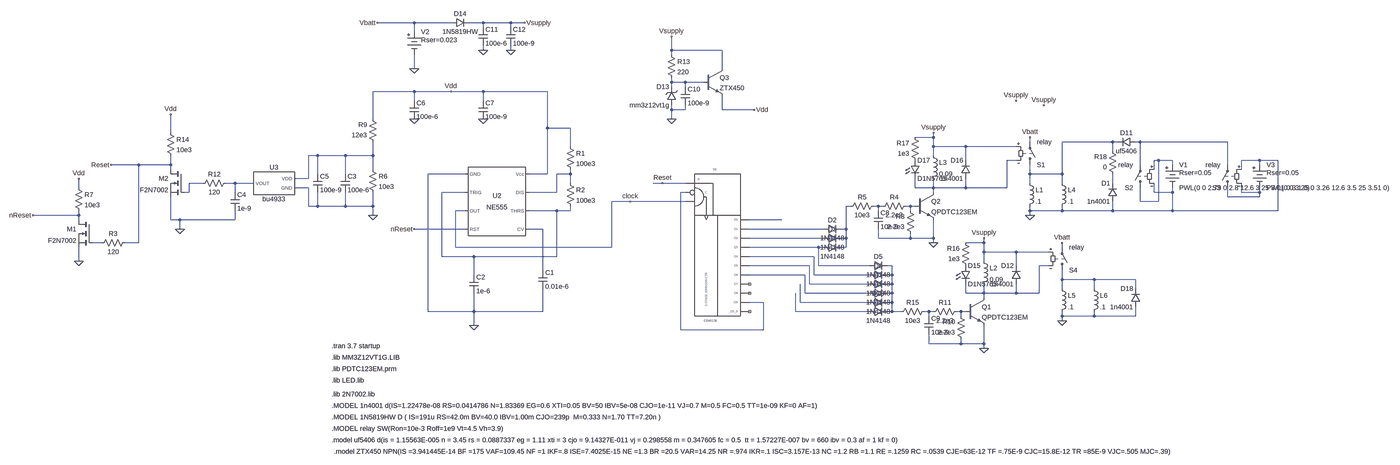
[diagram p0: schematic LockSequencer-6.asc, whole sheet]
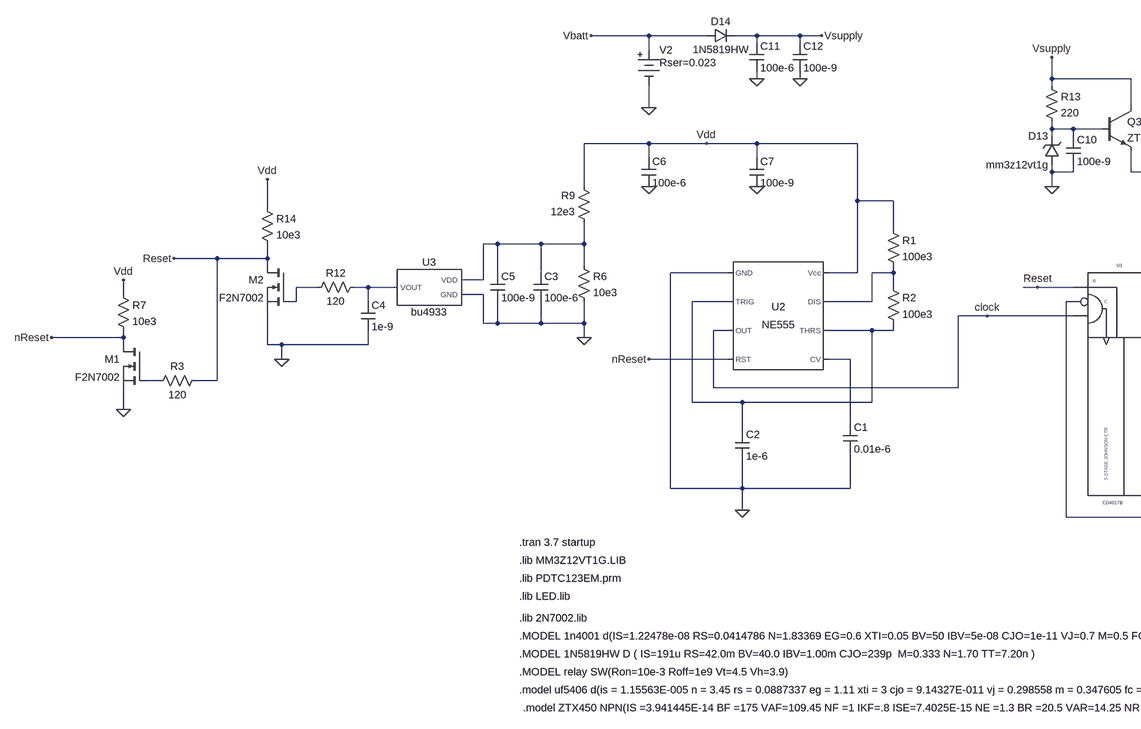
[diagram p1: schematic LockSequencer-6.asc, part, row 1 of 1, column 1 of 2]
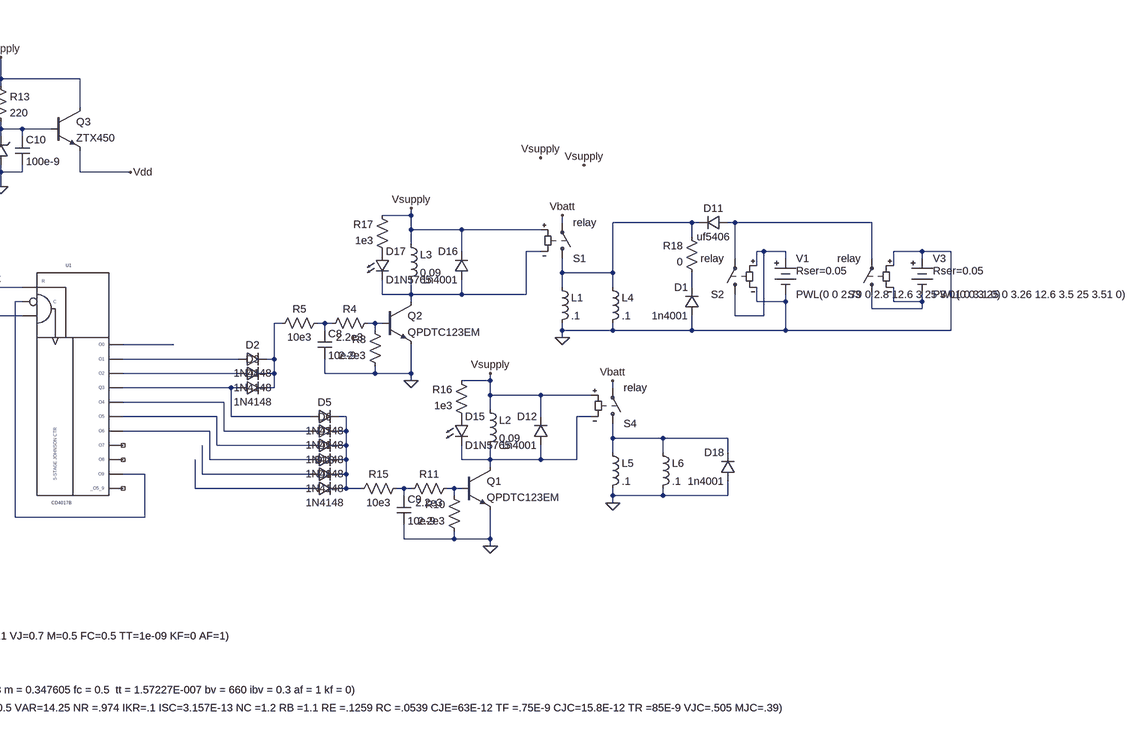
[diagram p2: schematic LockSequencer-6.asc, part, row 1 of 1, column 2 of 2]
LockSequencer-6.asc, the LTspice schematic file:
Version 4
SHEET 1 3068 1020
WIRE -832 -576 -960 -576
WIRE -704 -576 -832 -576
WIRE -592 -576 -640 -576
WIRE -496 -576 -592 -576
WIRE -448 -576 -496 -576
WIRE -592 -560 -592 -576
WIRE -496 -560 -496 -576
WIRE -832 -544 -832 -576
WIRE -592 -480 -592 -496
WIRE -496 -480 -496 -496
WIRE 64 -480 64 -528
WIRE 240 -480 64 -480
WIRE 64 -464 64 -480
WIRE -832 -416 -832 -464
WIRE 240 -416 240 -480
WIRE 64 -368 64 -384
WIRE 112 -368 64 -368
WIRE 176 -368 112 -368
WIRE 64 -352 64 -368
WIRE 112 -352 112 -368
WIRE -832 -336 -976 -336
WIRE -704 -336 -832 -336
WIRE -592 -336 -704 -336
WIRE -368 -336 -592 -336
WIRE -832 -304 -832 -336
WIRE -592 -304 -592 -336
WIRE 64 -272 64 -288
WIRE 112 -272 112 -288
WIRE 112 -272 64 -272
WIRE 240 -272 240 -320
WIRE 352 -272 240 -272
WIRE -976 -240 -976 -336
WIRE 64 -240 64 -272
WIRE -368 -208 -368 -336
WIRE -288 -208 -368 -208
WIRE -1680 -192 -1680 -256
WIRE 976 -176 976 -192
WIRE 976 -176 912 -176
WIRE 1312 -160 1312 -176
WIRE 1600 -160 1424 -160
WIRE 1616 -160 1600 -160
WIRE 1696 -160 1680 -160
WIRE 2000 -160 1696 -160
WIRE -288 -144 -288 -208
WIRE 976 -144 976 -176
WIRE 1088 -144 976 -144
WIRE 1264 -144 1088 -144
WIRE 1600 -128 1600 -160
WIRE -1168 -112 -1200 -112
WIRE -1072 -112 -1168 -112
WIRE -976 -112 -976 -160
WIRE -976 -112 -1072 -112
WIRE 976 -112 976 -144
WIRE 1088 -96 1088 -144
WIRE 1264 -96 1232 -96
WIRE 1760 -96 1744 -96
WIRE 1808 -96 1760 -96
WIRE 2112 -96 2048 -96
WIRE 2176 -96 2112 -96
WIRE -1792 -80 -1888 -80
WIRE -1680 -80 -1680 -112
WIRE -1680 -80 -1792 -80
WIRE 1696 -80 1696 -160
WIRE 1808 -80 1808 -96
WIRE 2000 -80 2000 -160
WIRE 2112 -80 2112 -96
WIRE -1680 -64 -1680 -80
WIRE -976 -64 -976 -112
WIRE 1744 -64 1744 -96
WIRE 2048 -64 2048 -96
WIRE -1168 -48 -1168 -112
WIRE -1072 -48 -1072 -112
WIRE -656 -48 -784 -48
WIRE -368 -48 -368 -208
WIRE -368 -48 -432 -48
WIRE -288 -48 -288 -64
WIRE -288 -48 -336 -48
WIRE 1312 -48 1312 -80
WIRE 1424 -48 1424 -160
WIRE 1424 -48 1312 -48
WIRE -1200 -32 -1200 -112
WIRE -1200 -32 -1248 -32
WIRE -1568 -16 -1616 -16
WIRE -1456 -16 -1488 -16
WIRE -1392 -16 -1456 -16
WIRE -288 -16 -288 -48
WIRE 32 -16 0 -16
WIRE 112 -16 32 -16
WIRE 1312 -16 1312 -48
WIRE 1424 -16 1424 -48
WIRE 1600 -16 1600 -48
WIRE -2000 0 -2000 -32
WIRE -1200 0 -1248 0
WIRE 912 0 912 -32
WIRE 976 0 976 -32
WIRE 976 0 912 0
WIRE 1088 0 1088 -32
WIRE 1088 0 976 0
WIRE 1232 0 1232 -96
WIRE 1232 0 1088 0
WIRE -1616 16 -1616 -16
WIRE -1616 16 -1632 16
WIRE -1456 16 -1456 -16
WIRE -656 16 -736 16
WIRE -336 16 -336 -48
WIRE -336 16 -432 16
WIRE 112 16 96 16
WIRE 976 16 976 0
WIRE 1744 16 1744 -16
WIRE 1808 16 1808 0
WIRE 1808 16 1744 16
WIRE 2048 16 2048 -16
WIRE 2112 16 2112 0
WIRE 2112 16 2048 16
WIRE 2000 32 2000 0
WIRE 2112 32 2112 16
WIRE 2112 32 2000 32
WIRE -80 48 -144 48
WIRE 112 48 -80 48
WIRE 1696 48 1696 0
WIRE 1760 48 1760 -96
WIRE 1760 48 1696 48
WIRE -1200 64 -1200 0
WIRE -1168 64 -1168 16
WIRE -1168 64 -1200 64
WIRE -1072 64 -1072 16
WIRE -1072 64 -1168 64
WIRE -976 64 -976 16
WIRE -976 64 -1072 64
WIRE 688 64 672 64
WIRE 784 64 768 64
WIRE 800 64 784 64
WIRE 896 64 880 64
WIRE 912 64 896 64
WIRE -656 80 -688 80
WIRE -336 80 -432 80
WIRE -288 80 -288 64
WIRE -288 80 -336 80
WIRE 784 80 784 64
WIRE 896 80 896 64
WIRE 1312 80 1312 64
WIRE 1424 80 1424 64
WIRE 1424 80 1312 80
WIRE 1600 80 1600 48
WIRE 1600 80 1424 80
WIRE 1808 80 1808 16
WIRE 1808 80 1600 80
WIRE 2176 80 2176 -96
WIRE 2176 80 1808 80
WIRE -2000 96 -2000 80
WIRE -2000 96 -2160 96
WIRE -976 96 -976 64
WIRE 1312 96 1312 80
WIRE -2000 112 -2000 96
WIRE -1680 112 -1680 32
WIRE -1648 112 -1680 112
WIRE -1456 112 -1456 80
WIRE -1456 112 -1648 112
WIRE 448 112 336 112
WIRE -1648 144 -1648 112
WIRE -656 144 -832 144
WIRE -384 144 -432 144
WIRE 592 144 336 144
WIRE 672 144 672 64
WIRE 672 144 656 144
WIRE 592 176 336 176
WIRE 672 176 672 144
WIRE 672 176 656 176
WIRE 784 176 784 144
WIRE 896 176 896 160
WIRE 896 176 784 176
WIRE 976 176 976 112
WIRE 976 176 896 176
WIRE -1920 192 -1952 192
WIRE -1792 192 -1792 -80
WIRE -1792 192 -1840 192
WIRE 976 192 976 176
WIRE 1152 192 1152 176
WIRE 1152 192 1088 192
WIRE -688 208 -688 80
WIRE -144 208 -144 48
WIRE -144 208 -688 208
WIRE 576 208 336 208
WIRE 592 208 576 208
WIRE 672 208 672 176
WIRE 672 208 656 208
WIRE 1424 208 1424 192
WIRE 1152 224 1152 192
WIRE 1264 224 1152 224
WIRE 1376 224 1264 224
WIRE -736 240 -736 16
WIRE -624 240 -736 240
WIRE -336 240 -336 80
WIRE -336 240 -624 240
WIRE 560 240 336 240
WIRE -2000 256 -2000 208
WIRE 1152 256 1152 224
WIRE 544 272 336 272
WIRE 576 272 576 208
WIRE 752 272 576 272
WIRE 832 272 816 272
WIRE 1264 272 1264 224
WIRE 1376 272 1344 272
WIRE -384 288 -384 144
WIRE -624 304 -624 240
WIRE 528 304 336 304
WIRE 560 304 560 240
WIRE 752 304 560 304
WIRE 832 304 832 272
WIRE 832 304 816 304
WIRE 1424 320 1424 288
WIRE 1536 320 1424 320
WIRE 1680 320 1536 320
WIRE 544 336 544 272
WIRE 752 336 544 336
WIRE 832 336 832 304
WIRE 832 336 816 336
WIRE 1424 352 1424 320
WIRE 1536 352 1536 320
WIRE 1680 352 1680 320
WIRE 528 368 528 304
WIRE 752 368 528 368
WIRE 832 368 832 336
WIRE 832 368 816 368
WIRE 1088 368 1088 336
WIRE 1152 368 1152 336
WIRE 1152 368 1088 368
WIRE 1264 368 1264 336
WIRE 1264 368 1152 368
WIRE 1344 368 1344 272
WIRE 1344 368 1264 368
WIRE 1152 384 1152 368
WIRE 384 400 336 400
WIRE 512 400 512 336
WIRE 752 400 512 400
WIRE 832 400 832 368
WIRE 832 400 816 400
WIRE -784 432 -784 -48
WIRE -624 432 -624 368
WIRE -624 432 -784 432
WIRE -384 432 -384 352
WIRE -384 432 -624 432
WIRE 496 432 496 368
WIRE 752 432 496 432
WIRE 832 432 832 400
WIRE 832 432 816 432
WIRE 864 432 832 432
WIRE 960 432 944 432
WIRE 976 432 960 432
WIRE 1072 432 1056 432
WIRE 1088 432 1072 432
WIRE 960 448 960 432
WIRE 1072 448 1072 432
WIRE 1424 448 1424 432
WIRE 1536 448 1536 432
WIRE 1536 448 1424 448
WIRE 1680 448 1680 416
WIRE 1680 448 1536 448
WIRE 1424 464 1424 448
WIRE -624 480 -624 432
WIRE 96 496 96 16
WIRE 384 496 384 400
WIRE 384 496 96 496
WIRE 960 544 960 512
WIRE 1072 544 1072 528
WIRE 1072 544 960 544
WIRE 1152 544 1152 480
WIRE 1152 544 1072 544
WIRE 1152 560 1152 544
FLAG -624 480 0
FLAG -704 -336 Vdd
FLAG -976 96 0
FLAG -1648 144 0
FLAG -1888 -80 Reset
FLAG 32 -16 Reset
FLAG -2000 -32 Vdd
FLAG -1680 -256 Vdd
FLAG -2160 96 nReset
FLAG -832 144 nReset
FLAG -2000 256 0
FLAG 976 192 0
FLAG 1152 560 0
FLAG -832 -240 0
FLAG -592 -240 0
FLAG -832 -416 0
FLAG -960 -576 Vbatt
FLAG 64 -240 0
FLAG 64 -528 Vsupply
FLAG 352 -272 Vdd
FLAG -448 -576 Vsupply
FLAG 1152 176 Vsupply
FLAG -80 48 clock
FLAG 976 -192 Vsupply
FLAG 1424 192 Vbatt
FLAG 1312 96 0
FLAG 1312 -176 Vbatt
FLAG 1424 464 0
FLAG 1264 -304 Vsupply
FLAG 1360 -288 Vsupply
FLAG -496 -480 0
FLAG -592 -480 0
SYMBOL Misc\\NE555 -544 48 R0
SYMATTR InstName U2
SYMBOL cap -400 288 R0
SYMATTR InstName C1
SYMATTR Value 0.01e-6
SYMATTR SpiceLine V=16
SYMBOL cap -640 304 R0
SYMATTR InstName C2
SYMATTR Value 1e-6
SYMATTR SpiceLine V=16
SYMBOL res -304 -160 R0
SYMATTR InstName R1
SYMATTR Value 100e3
SYMBOL res -304 -32 R0
SYMATTR InstName R2
SYMATTR Value 100e3
SYMBOL Dig_Add\\cd4017b 224 -80 R0
SYMATTR InstName U1
SYMATTR SpiceLine VDD=11.298  SPEED=1.0  TRIPDT=5e-9
SYMBOL cap -1088 -48 R0
SYMATTR InstName C3
SYMATTR Value 100e-6
SYMATTR SpiceLine V=16
SYMBOL cap -1472 16 R0
SYMATTR InstName C4
SYMATTR Value 1e-9
SYMATTR SpiceLine V=16
SYMBOL res -992 -80 R0
SYMATTR InstName R6
SYMATTR Value 10e3
SYMBOL res -960 -144 R180
WINDOW 0 36 76 Left 2
WINDOW 3 36 40 Left 2
SYMATTR InstName R9
SYMATTR Value 12e3
SYMBOL AutoGenerated\\bu4933 -1328 -16 R0
SYMATTR InstName U3
SYMBOL res -1472 -32 R90
WINDOW 0 0 56 VBottom 2
WINDOW 3 32 56 VTop 2
SYMATTR InstName R12
SYMATTR Value 120
SYMBOL res -1696 -208 R0
SYMATTR InstName R14
SYMATTR Value 10e3
SYMBOL nmos -1632 -64 M0
SYMATTR InstName M2
SYMATTR Value F2N7002
SYMATTR Prefix X
SYMBOL nmos -1952 112 M0
SYMATTR InstName M1
SYMATTR Value F2N7002
SYMATTR Prefix X
SYMBOL res -1824 176 R90
WINDOW 0 0 56 VBottom 2
WINDOW 3 32 56 VTop 2
SYMATTR InstName R3
SYMATTR Value 120
SYMBOL res -2016 -16 R0
SYMATTR InstName R7
SYMATTR Value 10e3
SYMBOL cap -1184 -48 R0
SYMATTR InstName C5
SYMATTR Value 100e-9
SYMATTR SpiceLine V=16
SYMBOL diode 592 160 R270
WINDOW 0 32 32 VTop 2
WINDOW 3 0 32 VBottom 2
SYMATTR InstName D2
SYMATTR Value 1N4148
SYMBOL diode 592 192 R270
WINDOW 0 32 32 VTop 2
WINDOW 3 0 32 VBottom 2
SYMATTR InstName D3
SYMATTR Value 1N4148
SYMBOL diode 592 224 R270
WINDOW 0 32 32 VTop 2
WINDOW 3 0 32 VBottom 2
SYMATTR InstName D4
SYMATTR Value 1N4148
SYMBOL diode 752 288 R270
WINDOW 0 32 32 VTop 2
WINDOW 3 0 32 VBottom 2
SYMATTR InstName D5
SYMATTR Value 1N4148
SYMBOL diode 752 320 R270
WINDOW 0 32 32 VTop 2
WINDOW 3 0 32 VBottom 2
SYMATTR InstName D6
SYMATTR Value 1N4148
SYMBOL diode 752 352 R270
WINDOW 0 32 32 VTop 2
WINDOW 3 0 32 VBottom 2
SYMATTR InstName D7
SYMATTR Value 1N4148
SYMBOL diode 752 448 R270
WINDOW 0 32 32 VTop 2
WINDOW 3 0 32 VBottom 2
SYMATTR InstName D8
SYMATTR Value 1N4148
SYMBOL diode 752 384 R270
WINDOW 0 32 32 VTop 2
WINDOW 3 0 32 VBottom 2
SYMATTR InstName D9
SYMATTR Value 1N4148
SYMBOL diode 752 416 R270
WINDOW 0 32 32 VTop 2
WINDOW 3 0 32 VBottom 2
SYMATTR InstName D10
SYMATTR Value 1N4148
SYMBOL npn 912 16 R0
SYMATTR InstName Q2
SYMATTR Value QPDTC123EM
SYMBOL res 896 48 R90
WINDOW 0 0 56 VBottom 2
WINDOW 3 32 56 VTop 2
SYMATTR InstName R4
SYMATTR Value 2.2e3
SYMBOL res 912 176 R180
WINDOW 0 36 76 Left 2
WINDOW 3 36 40 Left 2
SYMATTR InstName R8
SYMATTR Value 2.2e3
SYMBOL npn 1088 384 R0
SYMATTR InstName Q1
SYMATTR Value QPDTC123EM
SYMBOL res 1088 544 R180
WINDOW 0 36 76 Left 2
WINDOW 3 36 40 Left 2
SYMATTR InstName R10
SYMATTR Value 2.2e3
SYMBOL cap -848 -304 R0
SYMATTR InstName C6
SYMATTR Value 100e-6
SYMATTR SpiceLine V=16
SYMBOL cap -608 -304 R0
SYMATTR InstName C7
SYMATTR Value 100e-9
SYMATTR SpiceLine V=16
SYMBOL ind 1136 240 R0
SYMATTR InstName L2
SYMATTR Value 0.09
SYMATTR SpiceLine Rser=320
SYMBOL res 1072 416 R90
WINDOW 0 0 56 VBottom 2
WINDOW 3 32 56 VTop 2
SYMATTR InstName R11
SYMATTR Value 2.2e3
SYMBOL cap 768 80 R0
SYMATTR InstName C8
SYMATTR Value 10e-9
SYMATTR SpiceLine V=16
SYMBOL cap 944 448 R0
SYMATTR InstName C9
SYMATTR Value 10e-9
SYMATTR SpiceLine V=16
SYMBOL diode 1280 336 R180
WINDOW 0 24 64 Left 2
WINDOW 3 24 0 Left 2
SYMATTR InstName D12
SYMATTR Value 1n4001
SYMBOL Misc\\battery -832 -560 R0
WINDOW 123 0 0 Left 2
WINDOW 39 24 44 Left 2
WINDOW 3 24 104 Invisible 2
SYMATTR SpiceLine Rser=0.023
SYMATTR InstName V2
SYMATTR Value PWL(0 0 .25 5 0.5 5 0.55 12.75 2 12.75 3 13.8 3.1 0)
SYMBOL diode -704 -560 R270
WINDOW 0 32 32 VTop 2
WINDOW 3 0 32 VBottom 2
SYMATTR InstName D14
SYMATTR Value 1N5819HW
SYMBOL res 48 -480 R0
SYMATTR InstName R13
SYMATTR Value 220
SYMBOL zener 80 -288 R180
WINDOW 0 24 64 Left 2
WINDOW 3 24 0 Left 2
SYMATTR InstName D13
SYMATTR Value mm3z12vt1g
SYMATTR Prefix X
SYMBOL npn 176 -416 R0
SYMATTR InstName Q3
SYMATTR Value ZTX450
SYMBOL cap 96 -352 R0
SYMATTR InstName C10
SYMATTR Value 100e-9
SYMATTR SpiceLine V=16
SYMBOL res 784 48 R90
WINDOW 0 0 56 VBottom 2
WINDOW 3 32 56 VTop 2
SYMATTR InstName R5
SYMATTR Value 10e3
SYMBOL res 960 416 R90
WINDOW 0 0 56 VBottom 2
WINDOW 3 32 56 VTop 2
SYMATTR InstName R15
SYMATTR Value 10e3
SYMBOL LED 1072 272 R0
SYMATTR InstName D15
SYMATTR Value D1N5765
SYMATTR Prefix X
SYMBOL res 1104 288 R180
WINDOW 0 36 76 Left 2
WINDOW 3 36 40 Left 2
SYMATTR InstName R16
SYMATTR Value 1e3
SYMBOL ind 960 -128 R0
SYMATTR InstName L3
SYMATTR Value 0.09
SYMATTR SpiceLine Rser=320
SYMBOL diode 1104 -32 R180
WINDOW 0 24 64 Left 2
WINDOW 3 24 0 Left 2
SYMATTR InstName D16
SYMATTR Value 1n4001
SYMBOL LED 896 -96 R0
SYMATTR InstName D17
SYMATTR Value D1N5765
SYMATTR Prefix X
SYMBOL res 928 -80 R180
WINDOW 0 36 76 Left 2
WINDOW 3 36 40 Left 2
SYMATTR InstName R17
SYMATTR Value 1e3
SYMBOL sw 1312 -64 M180
SYMATTR InstName S1
SYMATTR Value relay
SYMBOL ind 1296 -32 R0
SYMATTR InstName L1
SYMATTR Value .1
SYMATTR SpiceLine Rser=12
SYMBOL diode 1616 48 R180
WINDOW 0 24 64 Left 2
WINDOW 3 24 0 Left 2
SYMATTR InstName D1
SYMATTR Value 1n4001
SYMBOL ind 1408 -32 R0
SYMATTR InstName L4
SYMATTR Value .1
SYMATTR SpiceLine Rser=12
SYMBOL Misc\\battery 1808 -96 R0
WINDOW 123 0 0 Left 2
WINDOW 39 24 44 Left 2
SYMATTR SpiceLine Rser=0.05
SYMATTR InstName V1
SYMATTR Value PWL(0 0 2.79 0 2.8 12.6 3 25 3.01 0 3.1 0)
SYMBOL sw 1696 16 R180
SYMATTR InstName S2
SYMATTR Value relay
SYMBOL Misc\\battery 2112 -96 R0
WINDOW 123 0 0 Left 2
WINDOW 39 24 44 Left 2
SYMATTR SpiceLine Rser=0.05
SYMATTR InstName V3
SYMATTR Value PWL(0 0 3.25 0 3.26 12.6 3.5 25 3.51 0)
SYMBOL sw 2000 16 R180
SYMATTR InstName S3
SYMATTR Value relay
SYMBOL diode 1680 -176 R90
WINDOW 0 0 32 VBottom 2
WINDOW 3 32 32 VTop 2
SYMATTR InstName D11
SYMATTR Value uf5406
SYMBOL sw 1424 304 M180
SYMATTR InstName S4
SYMATTR Value relay
SYMBOL ind 1408 336 R0
SYMATTR InstName L5
SYMATTR Value .1
SYMATTR SpiceLine Rser=12
SYMBOL ind 1520 336 R0
SYMATTR InstName L6
SYMATTR Value .1
SYMATTR SpiceLine Rser=12
SYMBOL cap -608 -560 R0
SYMATTR InstName C11
SYMATTR Value 100e-6
SYMATTR SpiceLine V=16
SYMBOL cap -512 -560 R0
SYMATTR InstName C12
SYMATTR Value 100e-9
SYMATTR SpiceLine V=16
SYMBOL diode 1696 416 R180
WINDOW 0 24 64 Left 2
WINDOW 3 24 0 Left 2
SYMATTR InstName D18
SYMATTR Value 1n4001
SYMBOL res 1616 -32 R180
WINDOW 0 36 76 Left 2
WINDOW 3 36 40 Left 2
SYMATTR InstName R18
SYMATTR Value 0
TEXT -1120 552 Left 2 !.tran 3.7 startup
TEXT -1120 592 Left 2 !.lib MM3Z12VT1G.LIB
TEXT -1120 632 Left 2 !.lib PDTC123EM.prm
TEXT -1120 720 Left 2 !.lib 2N7002.lib
TEXT -1120 760 Left 2 !.MODEL 1n4001 d(IS=1.22478e-08 RS=0.0414786 N=1.83369 EG=0.6 XTI=0.05 BV=50 IBV=5e-08 CJO=1e-11 VJ=0.7 M=0.5 FC=0.5 TT=1e-09 KF=0 AF=1)
TEXT -1120 800 Left 2 !.MODEL 1N5819HW D ( IS=191u RS=42.0m BV=40.0 IBV=1.00m CJO=239p  M=0.333 N=1.70 TT=7.20n )
TEXT -1120 672 Left 2 !.lib LED.lib
TEXT -1120 840 Left 2 !.MODEL relay SW(Ron=10e-3 Roff=1e9 Vt=4.5 Vh=3.9)
TEXT -1120 880 Left 2 !.model uf5406 d(is = 1.15563E-005 n = 3.45 rs = 0.0887337 eg = 1.11 xti = 3 cjo = 9.14327E-011 vj = 0.298558 m = 0.347605 fc = 0.5  tt = 1.57227E-007 bv = 660 ibv = 0.3 af = 1 kf = 0)
TEXT -1112 920 Left 2 !.model ZTX450 NPN(IS =3.941445E-14 BF =175 VAF=109.45 NF =1 IKF=.8 ISE=7.4025E-15 NE =1.3 BR =20.5 VAR=14.25 NR =.974 IKR=.1 ISC=3.157E-13 NC =1.2 RB =1.1 RE =.1259 RC =.0539 CJE=63E-12 TF =.75E-9 CJC=15.8E-12 TR =85E-9 VJC=.505 MJC=.39)

The netlist it stands for:
* LockSequencer-6.asc
XU2 0 N011 clock nReset N018 N011 N007 Vdd NE555  ; pins GND TRIG OUT RST CV THRS DIS Vcc
C1 N018 0 0.01e-6 V=16
C2 N011 0 1e-6 V=16
R1 Vdd N007 100e3
R2 N007 N011 100e3
XU1 Reset N012 clock N017 N019 N020 N022 N023 N024 N027 NC_01 NC_02 N012 NC_03 VDD 0 CD4017B VDD=11.298  SPEED=1.0  TRIPDT=5e-9  ; pins MR CPN CP Q0 Q1 Q2 Q3 Q4 Q5 Q6 Q7 Q8 Q9 Q59
C3 N004 0 100e-6 V=16
C4 N009 0 1e-9 V=16
R6 N004 0 10e3
R9 N004 Vdd 12e3
XU3 N009 N004 0 bu4933  ; pins VOUT VDD GND
R12 N009 N008 120
R14 Vdd Reset 10e3
XM2 Reset N008 0 F2N7002  ; pins D G S
XM1 nReset N021 0 F2N7002  ; pins D G S
R3 Reset N021 120
R7 Vdd nReset 10e3
C5 N004 0 100e-9 V=16
D2 N019 N014 1N4148
D3 N020 N014 1N4148
D4 N022 N014 1N4148
D5 N022 N025 1N4148
D6 N023 N025 1N4148
D7 N024 N025 1N4148
D8 N030 N025 1N4148
D9 N027 N025 1N4148
D10 N029 N025 1N4148
Q2 N005 N016 0 0 QPDTC123EM
R4 N016 N015 2.2e3
R8 0 N016 2.2e3
Q1 N026 N032 0 0 QPDTC123EM
R10 0 N032 2.2e3
C6 Vdd 0 100e-6 V=16
C7 Vdd 0 100e-9 V=16
L2 Vsupply N026 0.09 Rser=320
R11 N032 N031 2.2e3
C8 N015 0 10e-9 V=16
C9 N031 0 10e-9 V=16
D12 N026 Vsupply 1n4001
V2 Vbatt 0 PWL(0 0 .25 5 0.5 5 0.55 12.75 2 12.75 3 13.8 3.1 0) Rser=0.023
D14 Vbatt Vsupply 1N5819HW
R13 Vsupply N001 220
XD13 0 N001 mm3z12vt1g  ; pins + -
Q3 Vsupply N001 Vdd 0 ZTX450
C10 N001 0 100e-9 V=16
R5 N015 N014 10e3
R15 N031 N025 10e3
XD15 P001 N026 D1N5765  ; pins + -
R16 P001 Vsupply 1e3
L3 Vsupply N005 0.09 Rser=320
D16 N005 Vsupply 1n4001
XD17 P002 N005 D1N5765  ; pins + -
R17 P002 Vsupply 1e3
S1 N002 Vbatt Vsupply N005 relay
L1 N002 0 .1 Rser=12
D1 0 N010 1n4001
L4 N002 0 .1 Rser=12
V1 N006 0 PWL(0 0 2.79 0 2.8 12.6 3 25 3.01 0 3.1 0) Rser=0.05
S2 N006 N003 N006 0 relay
V3 0 N013 PWL(0 0 3.25 0 3.26 12.6 3.5 25 3.51 0) Rser=0.05
S3 N013 N003 0 N013 relay
D11 N003 N002 uf5406
S4 N028 Vbatt Vsupply N026 relay
L5 N028 0 .1 Rser=12
L6 N028 0 .1 Rser=12
C11 Vsupply 0 100e-6 V=16
C12 Vsupply 0 100e-9 V=16
D18 0 N028 1n4001
R18 N010 N002 0
.model D D
.lib standard.dio
.model NPN NPN
.model PNP PNP
.lib standard.bjt
.tran 3.7 startup
.lib MM3Z12VT1G.LIB
.lib PDTC123EM.prm
.lib 2N7002.lib
.MODEL 1n4001 d(IS=1.22478e-08 RS=0.0414786 N=1.83369 EG=0.6 XTI=0.05 BV=50 IBV=5e-08 CJO=1e-11 VJ=0.7 M=0.5 FC=0.5 TT=1e-09 KF=0 AF=1)
.MODEL 1N5819HW D ( IS=191u RS=42.0m BV=40.0 IBV=1.00m CJO=239p  M=0.333 N=1.70 TT=7.20n )
.lib LED.lib
.MODEL relay SW(Ron=10e-3 Roff=1e9 Vt=4.5 Vh=3.9)
.model uf5406 d(is = 1.15563E-005 n = 3.45 rs = 0.0887337 eg = 1.11 xti = 3 cjo = 9.14327E-011 vj = 0.298558 m = 0.347605 fc = 0.5  tt = 1.57227E-007 bv = 660 ibv = 0.3 af = 1 kf = 0)
.model ZTX450 NPN(IS =3.941445E-14 BF =175 VAF=109.45 NF =1 IKF=.8 ISE=7.4025E-15 NE =1.3 BR =20.5 VAR=14.25 NR =.974 IKR=.1 ISC=3.157E-13 NC =1.2 RB =1.1 RE =.1259 RC =.0539 CJE=63E-12 TF =.75E-9 CJC=15.8E-12 TR =85E-9 VJC=.505 MJC=.39)
.lib NE555.sub
.lib cd4000.lib
.lib BU4933.LIB
.backanno
.end